# Altium schematic sheet 08_FPGA.SchDoc: FPGA
size A3; Organization: Lime Microsystems; Address1: Surrey Tech Centre; Address2: Guildford GU2 7YG; Address3: Surrey; Address4: United Kingdom; Revision: v1.1; SheetNumber: 8; SheetTotal: 10
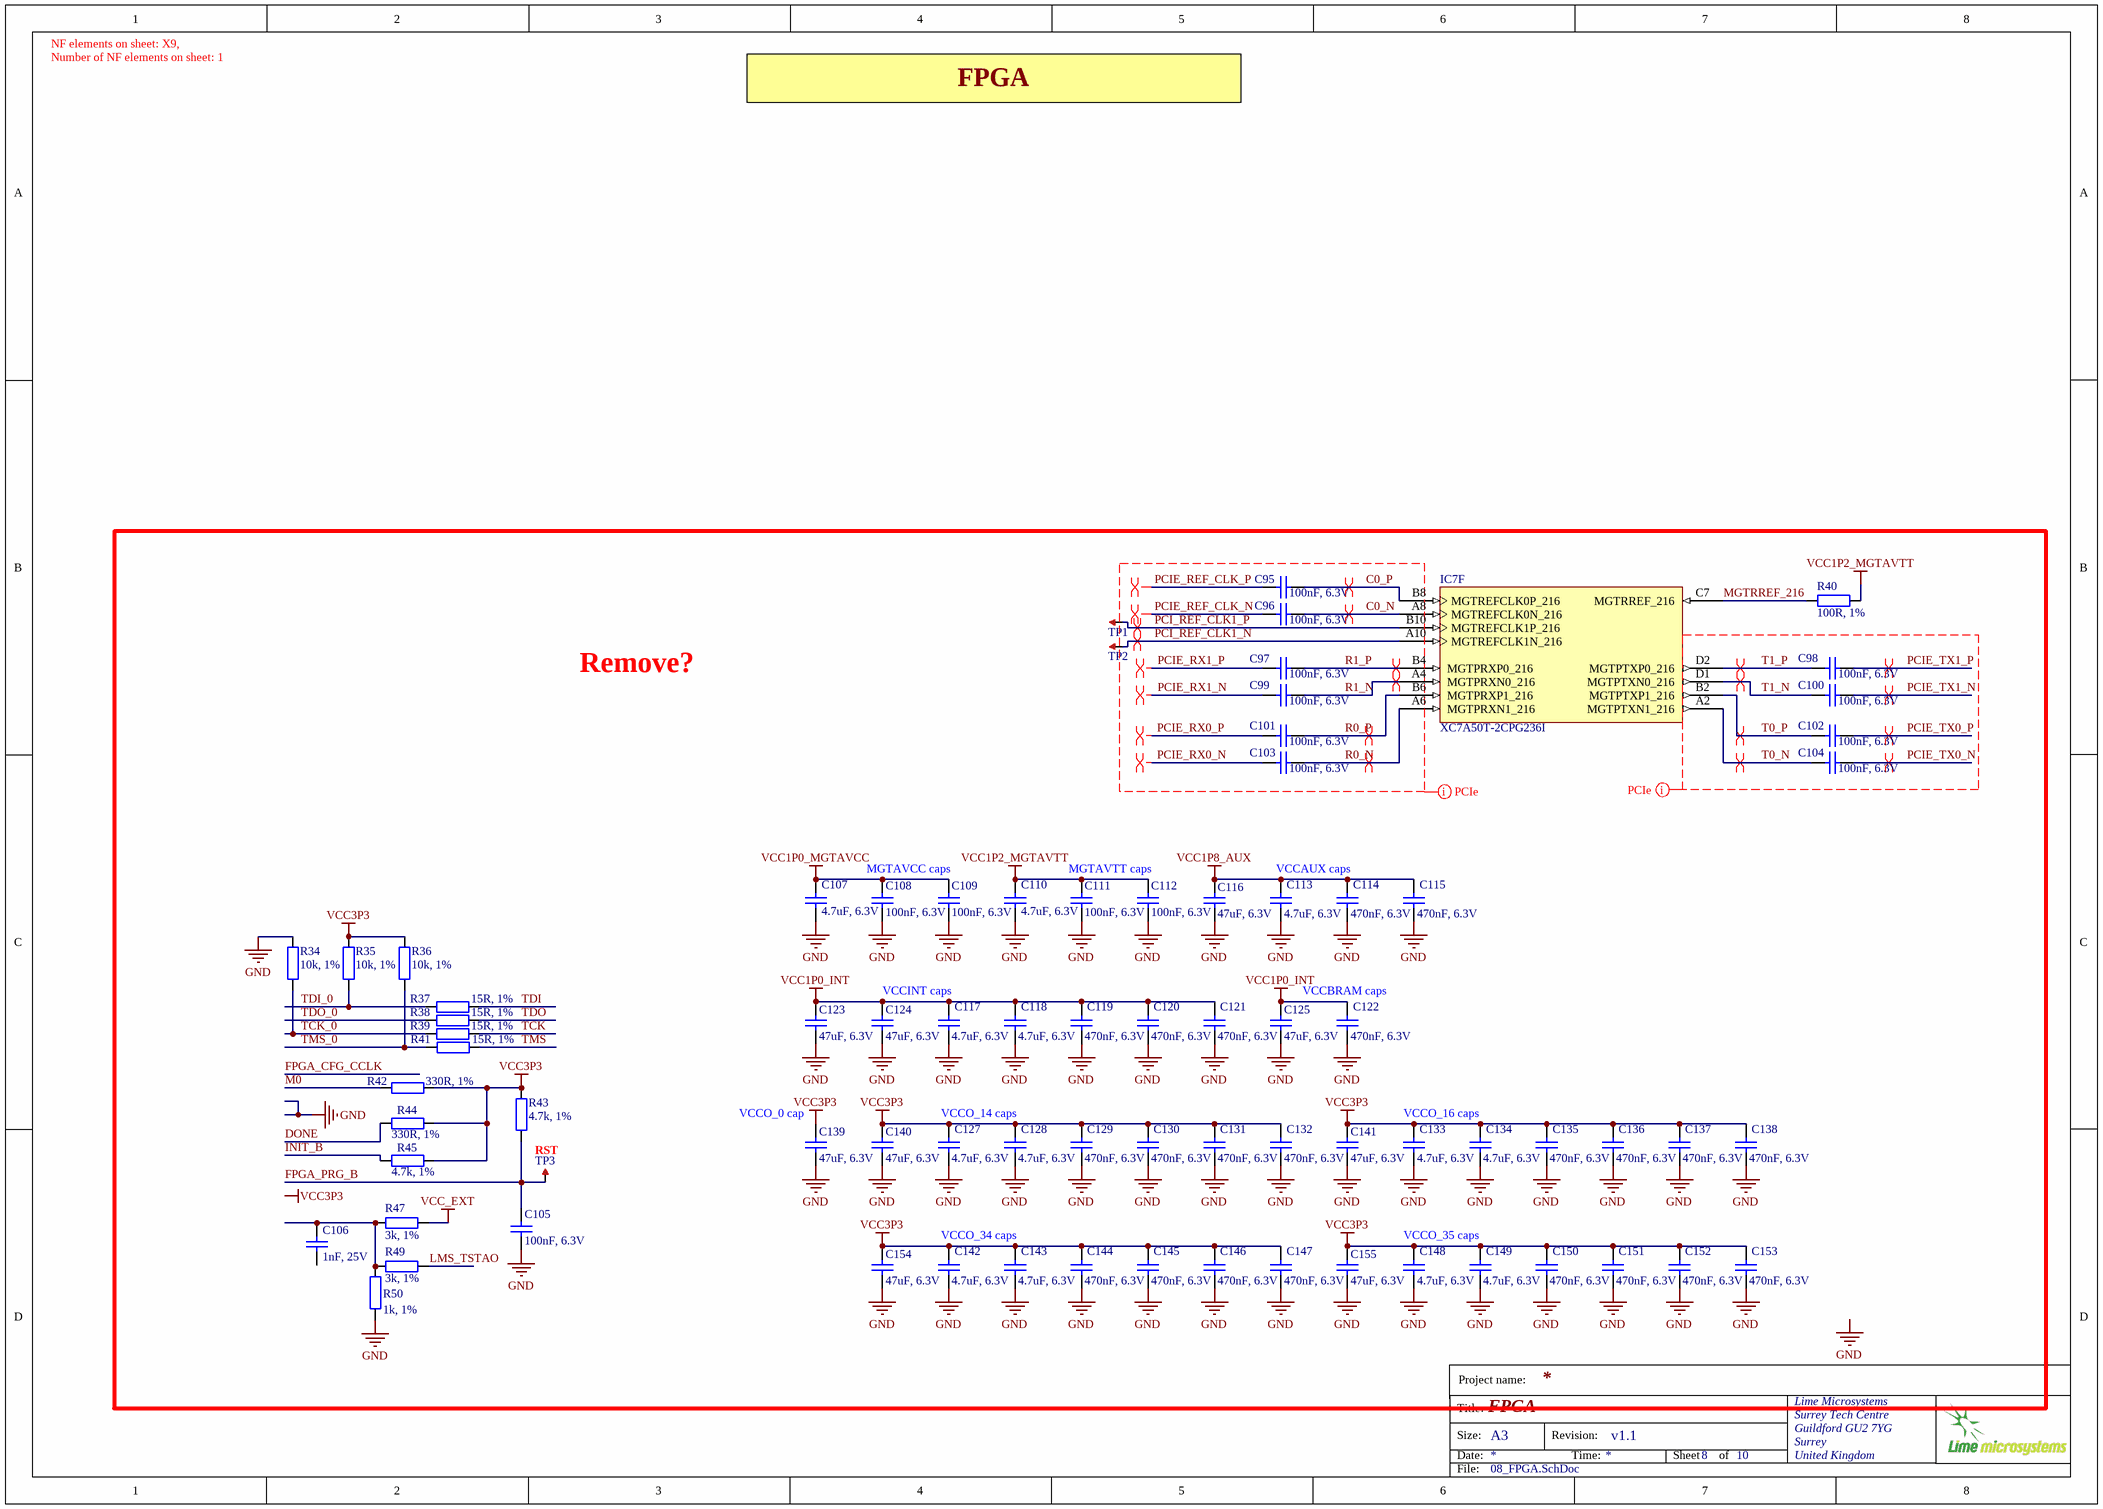
[diagram p0: 08_FPGA.SchDoc]

## Parts
C95  100nF, 6.3V  [CAP0201]
C96  100nF, 6.3V  [CAP0201]
C97  100nF, 6.3V  [CAP0201]
C98  100nF, 6.3V  [CAP0201]
C99  100nF, 6.3V  [CAP0201]
C100  100nF, 6.3V  [CAP0201]
C101  100nF, 6.3V  [CAP0201]
C102  100nF, 6.3V  [CAP0201]
C103  100nF, 6.3V  [CAP0201]
C104  100nF, 6.3V  [CAP0201]
C105  100nF, 6.3V  [CAP0201]
C106  1nF, 25V  [CAP0201]
C107  4.7uF, 6.3V  [CAP0402]
C108  100nF, 6.3V  [CAP0201]
C109  100nF, 6.3V  [CAP0201]
C110  4.7uF, 6.3V  [CAP0402]
C111  100nF, 6.3V  [CAP0201]
C112  100nF, 6.3V  [CAP0201]
C113  4.7uF, 6.3V  [CAP0402]
C114  470nF, 6.3V  [CAP0201]
C115  470nF, 6.3V  [CAP0201]
C116  47uF, 6.3V  [CAP0603]
C117  4.7uF, 6.3V  [CAP0402]
C118  4.7uF, 6.3V  [CAP0402]
C119  470nF, 6.3V  [CAP0201]
C120  470nF, 6.3V  [CAP0201]
C121  470nF, 6.3V  [CAP0201]
C122  470nF, 6.3V  [CAP0201]
C123  47uF, 6.3V  [CAP0603]
C124  47uF, 6.3V  [CAP0603]
C125  47uF, 6.3V  [CAP0603]
C127  4.7uF, 6.3V  [CAP0402]
C128  4.7uF, 6.3V  [CAP0402]
C129  470nF, 6.3V  [CAP0201]
C130  470nF, 6.3V  [CAP0201]
C131  470nF, 6.3V  [CAP0201]
C132  470nF, 6.3V  [CAP0201]
C133  4.7uF, 6.3V  [CAP0402]
C134  4.7uF, 6.3V  [CAP0402]
C135  470nF, 6.3V  [CAP0201]
C136  470nF, 6.3V  [CAP0201]
C137  470nF, 6.3V  [CAP0201]
C138  470nF, 6.3V  [CAP0201]
C139  47uF, 6.3V  [CAP0603]
C140  47uF, 6.3V  [CAP0603]
C141  47uF, 6.3V  [CAP0603]
C142  4.7uF, 6.3V  [CAP0402]
C143  4.7uF, 6.3V  [CAP0402]
C144  470nF, 6.3V  [CAP0201]
C145  470nF, 6.3V  [CAP0201]
C146  470nF, 6.3V  [CAP0201]
C147  470nF, 6.3V  [CAP0201]
C148  4.7uF, 6.3V  [CAP0402]
C149  4.7uF, 6.3V  [CAP0402]
C150  470nF, 6.3V  [CAP0201]
C151  470nF, 6.3V  [CAP0201]
C152  470nF, 6.3V  [CAP0201]
C153  470nF, 6.3V  [CAP0201]
C154  47uF, 6.3V  [CAP0603]
C155  47uF, 6.3V  [CAP0603]
IC7  XC7A50T-2CPG236I  [XC7A35T-2CPG236]  (part F of 10)
R34  10k, 1%  [RES0201]
R35  10k, 1%  [RES0201]
R36  10k, 1%  [RES0201]
R37  15R, 1%  [RES0201]
R38  15R, 1%  [RES0201]
R39  15R, 1%  [RES0201]
R40  100R, 1%  [RES0201]
R41  15R, 1%  [RES0201]
R42  330R, 1%  [RES0201]
R43  4.7k, 1%  [RES0201]
R44  330R, 1%  [RES0201]
R45  4.7k, 1%  [RES0201]
R47  3k, 1%  [RES0201]
R49  3k, 1%  [RES0201]
R50  1k, 1%  [RES0201]
TP1  TESTPOINT_PAD  [TP_PAD_1MM]  (value not drawn)  (no BOM)
TP2  TESTPOINT_PAD  [TP_PAD_1MM]  (value not drawn)  (no BOM)
TP3  TESTPOINT_PAD  [TP_PAD_1MM]  (value not drawn)  (no BOM)

## Nets
GND: C105.2 C107.1 C108.2 C109.2 C110.1 C111.2 C112.2 C113.1 C114.2 C115.2 C116.1 C117.1 C118.1 C119.2 C120.2 C121.2 C122.2 C123.1 C124.1 C125.1 C127.1 C128.1 C129.2 C130.2 C131.2 C132.2 C133.1 C134.1 C135.2 C136.2 C137.2 C138.2 C139.1 C140.1 C141.1 C142.1 C143.1 C144.2 C145.2 C146.2 C147.2 C148.1 C149.1 C150.2 C151.2 C152.2 C153.2 C154.1 C155.1 R34.1 R50.2
VCC1P0_INT: C117.2 C118.2 C119.1 C120.1 C121.1 C122.1 C123.2 C124.2 C125.2
VCC1P0_MGTAVCC: C107.2 C108.1 C109.1
VCC1P2_MGTAVTT: C110.2 C111.1 C112.1 R40.1
VCC1P8_AUX: C113.2 C114.1 C115.1 C116.2
VCC3P3: C127.2 C128.2 C129.1 C130.1 C131.1 C132.1 C133.2 C134.2 C135.1 C136.1 C137.1 C138.1 C139.2 C140.2 C141.2 C142.2 C143.2 C144.1 C145.1 C146.1 C147.1 C148.2 C149.2 C150.1 C151.1 C152.1 C153.1 C154.2 C155.2 R35.1 R36.1 R42.1 R43.1 R44.1 R45.1
VCC_EXT: R47.2
C0_N: C96.2 IC7.A8(MGTREFCLK0N_216)
C0_P: C95.2 IC7.B8(MGTREFCLK0P_216)
DONE: R44.2
FPGA_PRG_B: C105.1 R43.2 TP3.1
INIT_B: R45.2
LMS_TSTAO: R49.2
M0: R42.2
MGTRREF_216: IC7.C7(MGTRREF_216) R40.2
PCI_REF_CLK1_N: IC7.A10(MGTREFCLK1N_216) TP2.1
PCI_REF_CLK1_P: IC7.B10(MGTREFCLK1P_216) TP1.1
PCIE_REF_CLK_N: C96.1
PCIE_REF_CLK_P: C95.1
PCIE_RX0_N: C103.1
PCIE_RX0_P: C101.1
PCIE_RX1_N: C99.1
PCIE_RX1_P: C97.1
PCIE_TX0_N: C104.2
PCIE_TX0_P: C102.2
PCIE_TX1_N: C100.2
PCIE_TX1_P: C98.2
R0_N: C103.2 IC7.A6(MGTPRXN1_216)
R0_P: C101.2 IC7.B6(MGTPRXP1_216)
R1_N: C99.2 IC7.A4(MGTPRXN0_216)
R1_P: C97.2 IC7.B4(MGTPRXP0_216)
T0_N: C104.1 IC7.A2(MGTPTXN1_216)
T0_P: C102.1 IC7.B2(MGTPTXP1_216)
T1_N: C100.1 IC7.D1(MGTPTXN0_216)
T1_P: C98.1 IC7.D2(MGTPTXP0_216)
TCK: R39.1
TCK_0: R34.2 R39.2
TDI: R37.1
TDI_0: R35.2 R37.2
TDO: R38.1
TDO_0: R38.2
TMS: R41.1
TMS_0: R36.2 R41.2
NetC106_1: C106.1 R47.1 R49.1 R50.1

Not connected (* = marked no-connect by the designer): C106 2

## Layout directives
differential pair: C0_N, C0_P, PCI_REF_CLK1_N, PCI_REF_CLK1_P, PCIE_REF_CLK_N, PCIE_REF_CLK_P, PCIE_RX0_N, PCIE_RX0_P, PCIE_RX1_N, PCIE_RX1_P, PCIE_TX0_N, PCIE_TX0_P, PCIE_TX1_N, PCIE_TX1_P, R0_N, R0_P, R1_N, R1_P, T0_N, T0_P, T1_N, T1_P
net class PCIe: C0_N, C0_P, PCI_REF_CLK1_N, PCI_REF_CLK1_P, PCIE_REF_CLK_N, PCIE_REF_CLK_P, PCIE_RX0_N, PCIE_RX0_P, PCIE_RX1_N, PCIE_RX1_P, PCIE_TX0_N, PCIE_TX0_P, PCIE_TX1_N, PCIE_TX1_P, R0_N, R0_P, R1_N, R1_P, T0_N, T0_P, T1_N, T1_P

## Notes on the sheet
- NF elements on sheet: X9,
- Number of NF elements on sheet: 1
- FPGA
- Remove?
- MGTAVCC caps
- MGTAVTT caps
- VCCAUX caps
- VCCINT caps
- VCCBRAM caps
- (near C139) VCCO_0 cap
- VCCO_14 caps
- VCCO_16 caps
- RST
- VCCO_34 caps
- VCCO_35 caps
- Labels drawn without touching a wire or pin: GND, VCC3P3
- Project name:
- Title:
- Size:
- Date:
- A3
- Revision:
- Time:
- Sheet
- of
- File:

## Library data of the parts
C95-C97 C99 C101 C103 C105 C108 C109 C111 C112 = Cap_0402: Part Description: 100 pF ±5% 50V Ceramic Capacitor C0G, NP0 0201 (0603 Metric); Manufacturer: Samsung; Manufacturer Part Number 1: CL03A104MP3NNNC; Tolerance: 20%; Voltage Rating (DC): 10V; Value: 100nF, 6.3V; Capacitance: 100nF; Case/Package: 0201; Case Code (Imperial): 0201; Case Code (Metric): 0603; ComponentLink5Description: https://datasheet.ciiva.com/25788/cl03a104mp3nnnc-25788272.pdf?src-supplier=Digi-Key; ComponentLink5URL: https://datasheet.ciiva.com/25788/cl03a104mp3nnnc-25788272.pdf?src-supplier=Digi-Key; Length: 0.024inch; Max Operating Temperature: 85°C; Min Operating Temperature: -55°C; Mount: Surface Mount; Package Quantity: 1; Packaging: Tape and Reel; Pricing 1: 1=0,10000, 10=0,03000, 50=0,01640, 100=0,01330, 500=0,00950, 1000=0,00747, 2500=0,00679, 5000=0,00625 (USD); RoHS: Yes; RoHS Compliant: Yes; Series: CL; Stock 1: 3817176; Supplier 1: Digi-Key; Supplier Part Number 1: 1276-1321-1-ND; Thickness: 0.013inch; Voltage Rating: 10V; Width: 0.012inch
C98 C100 C102 C104 = Cap_0402: Manufacturer: Samsung; Manufacturer Part Number 1: CL03A104MP3NNNC; Part Description: 100 pF ±5% 50V Ceramic Capacitor C0G, NP0 0201 (0603 Metric); Tolerance: 20%; Voltage Rating (DC): 10V; ComponentLink5Description: https://datasheet.ciiva.com/25788/cl03a104mp3nnnc-25788272.pdf?src-supplier=Digi-Key; ComponentLink5URL: https://datasheet.ciiva.com/25788/cl03a104mp3nnnc-25788272.pdf?src-supplier=Digi-Key; Capacitance: 100nF; Case/Package: 0201; Case Code (Imperial): 0201; Case Code (Metric): 0603; Length: 0.024inch; Max Operating Temperature: 85°C; Min Operating Temperature: -55°C; Mount: Surface Mount; Package Quantity: 1; Packaging: Tape and Reel; Pricing 1: 1=0,10000, 10=0,03000, 50=0,01640, 100=0,01330, 500=0,00950, 1000=0,00747, 2500=0,00679, 5000=0,00625 (USD); RoHS: Yes; RoHS Compliant: Yes; Series: CL; Stock 1: 3817176; Supplier 1: Digi-Key; Supplier Part Number 1: 1276-1321-1-ND; Thickness: 0.013inch; Value: 100nF, 6.3V; Voltage Rating: 10V; Width: 0.012inch
C106 = Cap_0402: Manufacturer Part Number 1: C0603X7R1E102K030BA; Manufacturer: TDK Corporation; Part Description: 1000pF ±10% 25V X7R Ceramic Capacitor -55°C ~ 125°C Surface Mount, MLCC 0201 (0603 Metric) 0.024" L x 0.012" W (0.60mm x 0.30mm); Temperature Coefficient: X7R; Tolerance: ±10%; Capacitance: 1000pF; Value: 1nF, 25V; Supplier 1: Digi-Key; Supplier Part Number 1: 445-7275-1-ND; Voltage - Rated: 25V; Features: -; Package / Case: 0201 (0603 Metric); Lead Spacing: -; Mounting Type: Surface Mount, MLCC; Lead Style: -; Height - Seated (Max): -; Operating Temperature: -55°C ~ 125°C; Size / Dimension: 0.024" L x 0.012" W (0.60mm x 0.30mm); Applications: General Purpose; Ratings: -; Thickness (Max): 0.013" (0.33mm); RoHS: RoHS Compliant; Packaging: Cut Tape (CT); Category: Capacitors
C107 C110 C113 C117 C118 C127 C128 C133 C134 C142 C143 C148 C149 = Cap_0402: Manufacturer: Murata Electronics North America; Manufacturer Part Number 1: GRM155R60J475ME87D; Part Description: 4.7µF ±20% 6.3V X5R Ceramic Capacitor -55°C ~ 85°C Surface Mount, MLCC 0402 (1005 Metric) 0.039" L x 0.020" W (1.00mm x 0.50mm); Tolerance: ±20%; Capacitance: 4.7µF; Temperature Coefficient: X5R; Lead Style: -; Ratings: -; Height - Seated (Max): -; Thickness (Max): 0.022" (0.55mm); Voltage - Rated: 6.3V; Packaging: Cut Tape (CT); Lead Spacing: -; Category: Capacitors; Supplier Part Number 1: 490-5408-1-ND; Applications: General Purpose; Operating Temperature: -55°C ~ 85°C; Mounting Type: Surface Mount, MLCC; Features: Derating Recommended; RoHS: RoHS Compliant; Supplier 1: Digi-Key; Package / Case: 0402 (1005 Metric); Size / Dimension: 0.039" L x 0.020" W (1.00mm x 0.50mm); Value: 4.7uF, 6.3V
C114 C115 C119-C122 C129-C132 C135-C138 C144-C147 C150-C153 = Cap_0402: Manufacturer: Murata; Manufacturer Part Number 1: GRM033R60J474KE90D; Part Description: 0.47 µF ±10% 6.3V Ceramic Capacitor X5R 0201 (0603 Metric); Tolerance: 10%; Dielectric: X5R; Value: 470nF, 6.3V; Supplier 1: Digi-Key; Supplier Part Number 1: 490-10409-1-ND; Stock 1: 1562532; Pricing 1: 1=0,10000, 10=0,06000, 50=0,03280, 100=0,02670, 500=0,01908, 1000=0,01500, 2500=0,01364, 5000=0,01254 (USD); RoHS: Yes; Mount: Surface Mount; Case/Package: 0201; Case Code (Metric): 0603; Case Code (Imperial): 0201; Weight: 1.2E-05oz; Min Operating Temperature: -55°C; Max Operating Temperature: 85°C; Packaging: Tape and Reel; Capacitance: 470nF; Voltage Rating: 6.3V; Termination: SMD/SMT; Voltage Rating (DC): 6.3V; Package Quantity: 15000; Length: 0.6mm; Width: 0.012inch; Height: 0.3mm; Thickness: 0.013inch; Depth: 0.3mm; Lead Free: Lead Free; RoHS Compliant: Yes; ComponentLink1URL: http://www.farnell.com/datasheets/2867834.pdf?src-supplier=Farnell; ComponentLink1Description: http://www.farnell.com/datasheets/2867834.pdf?src-supplier=Farnell; ComponentLink2URL: http://www.mouser.com/ds/2/281/c02e-2905.pdf?src-supplier=Mouser; ComponentLink2Description: http://www.mouser.com/ds/2/281/c02e-2905.pdf?src-supplier=Mouser; ComponentLink3URL: http://www.farnell.com/datasheets/2867834.pdf?src-supplier=Element14; ComponentLink3Description: http://www.farnell.com/datasheets/2867834.pdf?src-supplier=Element14; ComponentLink4URL: http://search.murata.co.jp/Ceramy/image/img/A01X/G101/ENG/GRM033R60J474KE90-01.pdf?src-supplier=Digi-Key; ComponentLink4Description: http://search.murata.co.jp/Ceramy/image/img/A01X/G101/ENG/GRM033R60J474KE90-01.pdf?src-supplier=Digi-Key; ComponentLink5URL: http://www.farnell.com/datasheets/2867834.pdf?src-supplier=Newark; ComponentLink5Description: http://www.farnell.com/datasheets/2867834.pdf?src-supplier=Newark
C116 C123-C125 C139-C141 C154 C155 = Cap_0603: Part Description: 47 µF ±20% 6.3V Ceramic Capacitor X5R 0603 (1608 Metric); Manufacturer: Murata; Manufacturer Part Number 1: GRM188R60J476ME15D; Tolerance: 20%; Dielectric: X5R; Value: 47uF, 6.3V; Supplier 1: Digi-Key; Supplier Part Number 1: 490-13247-1-ND; Stock 1: 731453; Pricing 1: 1=0,45000, 10=0,31900, 50=0,24120, 100=0,21000, 500=0,15556, 1000=0,13223 (USD); RoHS: Yes; Mount: Surface Mount; Case/Package: 0603; Case Code (Metric): 1608; Case Code (Imperial): 0603; Min Operating Temperature: -55°C; Max Operating Temperature: 85°C; Packaging: Tape and Reel; Capacitance: 47uF; Voltage Rating: 6.3V; Voltage Rating (DC): 6.3V; Length: 0.063inch; Width: 0.031inch; Thickness: 0.039inch; RoHS Compliant: Yes; ComponentLink1URL: http://search.murata.co.jp/Ceramy/image/img/A01X/G101/ENG/GRM188R60J476ME15-01.pdf?src-supplier=Digi-Key; ComponentLink1Description: http://search.murata.co.jp/Ceramy/image/img/A01X/G101/ENG/GRM188R60J476ME15-01.pdf?src-supplier=Digi-Key; ComponentLink2URL: https://www.murata.com/~/media/webrenewal/support/library/catalog/products/capacitor/mlcc/c02e.ashx?la=en-us&src-supplier=Digi-Key; ComponentLink2Description: https://www.murata.com/~/media/webrenewal/support/library/catalog/products/capacitor/mlcc/c02e.ashx?la=en-us&src-supplier=Digi-Key
IC7 = XC7A35T-2CPG236: Artix-7 FPGA; Part Description: Artix-7 Field Programmable Gate Array (FPGA) IC 106 2764800 52160 238-LFBGA, CSPBGA; Manufacturer: Xilinx; Propagation Delay: 0.85ns; Speed Grade: 2; Number of Logic Blocks (LABs): 4075; Number of Logic Elements/Cells: 52160; RAM Size: 2764800b; Number of I/Os: 106; Number of Registers: 652; Min Supply Voltage: 950mV; Max Supply Voltage: 1.05V; ComponentLink1Description: Manufacturer URL; ComponentLink1URL: http://www.xilinx.com/; ComponentLink2Description: Datasheet; ComponentLink2URL: http://www.xilinx.com/support/documentation/data_sheets/ds180_7Series_Overview.pdf; ComponentLink3Description: Package Specification; ComponentLink3URL: http://www.xilinx.com/support/documentation/user_guides/ug475_7Series_Pkg_Pinout.pdf; ComponentLink4Description: DC and Switching Characteristics; ComponentLink4URL: http://www.xilinx.com/support/documentation/data_sheets/ds181_Artix_7_Data_Sheet.pdf; ComponentLink5Description: Package File; ComponentLink5URL: http://www.xilinx.com/support/packagefiles/a7packages/xc7a200tsbg484pkg.txt; ComponentLink6Description: Packaging and Pinout; ComponentLink6URL: http://www.xilinx.com/support/documentation/user_guides/ug475_7Series_Pkg_Pinout.pdf; ComponentLink7URL: http://www.farnell.com/datasheets/2553941.pdf?src-supplier=Farnell; ComponentLink7Description: http://www.farnell.com/datasheets/2553941.pdf?src-supplier=Farnell; ComponentLink8URL: http://www.xilinx.com/support/documentation/data_sheets/ds181_Artix_7_Data_Sheet.pdf?src-supplier=Avnet; ComponentLink8Description: http://www.xilinx.com/support/documentation/data_sheets/ds181_Artix_7_Data_Sheet.pdf?src-supplier=Avnet; ComponentLink9URL: https://www.xilinx.com/support/documentation/data_sheets/ds180_7Series_Overview.pdf?src-supplier=Digi-Key; ComponentLink9Description: https://www.xilinx.com/support/documentation/data_sheets/ds180_7Series_Overview.pdf?src-supplier=Digi-Key; Supplier 1: Digi-Key; Supplier Part Number 1: 122-2181-ND; Manufacturer Part Number 1: XC7A50T-2CPG236I; Stock 1: 0; RoHS: Yes; Mount: Surface Mount; Number of Pins: 236; Contact Plating: Copper,Tin,Silver; Min Operating Temperature: -40°C; Max Operating Temperature: 100°C; Turn-On Delay Time: 0.85ns; RoHS Compliant: Yes
R34-R36 = Res_0402: Manufacturer: Yageo; Manufacturer Part Number 1: RC0201FR-0710KL; Part Description: 10 kOhms ±1% 0.05W, 1/20W Chip Resistor 0201 (0603 Metric) Moisture Resistant Thick Film; Resistance: 10kR; Power Rating: 50mW; Voltage Rating: 25V; Temperature Coefficient: 200ppm/°C; Value: 10k, 1%; ComponentLink1URL: https://datasheet.ciiva.com/5924/1563626-5924912.pdf?src-supplier=Farnell; ComponentLink1Description: https://datasheet.ciiva.com/5924/1563626-5924912.pdf?src-supplier=Farnell; ComponentLink2URL: https://datasheet.ciiva.com/22661/1563626-22661319.pdf?src-supplier=Element14; ComponentLink2Description: https://datasheet.ciiva.com/22661/1563626-22661319.pdf?src-supplier=Element14; Supplier 1: Digi-Key; Supplier Part Number 1: 311-10.0KMCT-ND; Stock 1: 17142315; Pricing 1: 1=0,10000, 10=0,03700, 100=0,01530, 1000=0,00685, 2500=0,00595, 5000=0,00491 (USD); RoHS: Yes; Case/Package: 0201; Number of Pins: 2; Case Code (Imperial): 0201; Case Code (Metric): 0603; Contact Plating: Tin,Matte; Weight: 6E-06oz; Min Operating Temperature: -55°C; Max Operating Temperature: 125°C; Tolerance: 1%; Packaging: Tape and Reel; Package Quantity: 10000; Termination: SMD/SMT; Resistor Type: Thick Film; Number of Terminations: 2; Max Power Dissipation: 50mW; Voltage Rating (DC): 25V; Features: Moisture Resistant; Series: RC; Resistance Tolerance: 1%; Construction: Rectangular; Working Voltage: 25V; Technology: THICK FILM; Length: 0.6mm; Width: 0.012inch; Height: 0.01inch; Depth: 0.3mm; Radiation Hardening: No; Reach SVHC Compliant: Yes; Military Standard: Not; Lead Free: Lead Free; RoHS Compliant: Yes; ComponentLink3URL: https://datasheet.ciiva.com/7660/1421516-7660807.pdf?src-supplier=Element14; ComponentLink3Description: https://datasheet.ciiva.com/7660/1421516-7660807.pdf?src-supplier=Element14; ComponentLink4URL: https://datasheet.ciiva.com/46391/1421516-46391339.pdf?src-supplier=Element14; ComponentLink4Description: https://datasheet.ciiva.com/46391/1421516-46391339.pdf?src-supplier=Element14; ComponentLink5URL: https://datasheet.ciiva.com/2467/pyu-r-int-thick-7-2467110.pdf?src-supplier=Digi-Key; ComponentLink5Description: https://datasheet.ciiva.com/2467/pyu-r-int-thick-7-2467110.pdf?src-supplier=Digi-Key; ComponentLink6URL: https://datasheet.ciiva.com/2467/pyu-r-int-thick-7-2467111.pdf?src-supplier=Digi-Key; ComponentLink6Description: https://datasheet.ciiva.com/2467/pyu-r-int-thick-7-2467111.pdf?src-supplier=Digi-Key; ComponentLink7URL: https://datasheet.ciiva.com/2467/pyu-r-int-thick-7-2467109.pdf?src-supplier=Digi-Key; ComponentLink7Description: https://datasheet.ciiva.com/2467/pyu-r-int-thick-7-2467109.pdf?src-supplier=Digi-Key
R37-R39 R41 = Res_0402: Manufacturer: Yageo; Manufacturer Part Number 1: RC0201FR-0715RL; Part Description: 15 Ohms ±1% 0.05W, 1/20W Chip Resistor 0201 (0603 Metric) Moisture Resistant Thick Film; Power Rating: 50mW; Voltage Rating: 25V; Temperature Coefficient: 200ppm/°C; Value: 15R, 1%; ComponentLink1URL: https://datasheet.ciiva.com/5924/1563626-5924912.pdf?src-supplier=Farnell; ComponentLink1Description: https://datasheet.ciiva.com/5924/1563626-5924912.pdf?src-supplier=Farnell; ComponentLink2URL: https://datasheet.ciiva.com/22661/1563626-22661319.pdf?src-supplier=Element14; ComponentLink2Description: https://datasheet.ciiva.com/22661/1563626-22661319.pdf?src-supplier=Element14; Supplier 1: Digi-Key; Supplier Part Number 1: 311-15.0MCT-ND; Stock 1: 379739; Pricing 1: 1=0,10000, 10=0,03700, 100=0,01530, 1000=0,00685, 2500=0,00595, 5000=0,00491 (USD); RoHS: Yes; Case/Package: 0201; Case Code (Imperial): 0201; Case Code (Metric): 0603; Size Code: 0201; Min Operating Temperature: -55°C; Max Operating Temperature: 125°C; Resistance: 15R; Tolerance: 1%; Packaging: Cut Tape; Package Quantity: 1; Termination: SMD/SMT; Resistor Type: Thick Film; Number of Terminations: 2; Max Power Dissipation: 50mW; Features: Moisture Resistant; Series: RC; Resistance Tolerance: 1%; Length: 0.6mm; Width: 0.3mm; Height: 0.23mm; Lead Free: Lead Free; RoHS Compliant: Yes; ComponentLink3URL: https://datasheet.ciiva.com/7672/1563626-7672202.pdf?src-supplier=Element14; ComponentLink3Description: https://datasheet.ciiva.com/7672/1563626-7672202.pdf?src-supplier=Element14; ComponentLink4URL: https://datasheet.ciiva.com/2493/pyu-r-int-thick-7-2493785.pdf?src-supplier=Digi-Key; ComponentLink4Description: https://datasheet.ciiva.com/2493/pyu-r-int-thick-7-2493785.pdf?src-supplier=Digi-Key; ComponentLink5URL: https://datasheet.ciiva.com/2493/pyu-r-int-thick-7-2493786.pdf?src-supplier=Digi-Key; ComponentLink5Description: https://datasheet.ciiva.com/2493/pyu-r-int-thick-7-2493786.pdf?src-supplier=Digi-Key; ComponentLink6URL: https://datasheet.ciiva.com/2493/pyu-r-int-thick-7-2493784.pdf?src-supplier=Digi-Key; ComponentLink6Description: https://datasheet.ciiva.com/2493/pyu-r-int-thick-7-2493784.pdf?src-supplier=Digi-Key
R40 = Res_0402: Manufacturer: Yageo; Manufacturer Part Number 1: RC0201FR-07100RL; Part Description: 100 Ohms ±1% 0.05W, 1/20W Chip Resistor 0201 (0603 Metric) Moisture Resistant Thick Film; Power Rating: 50mW; Voltage Rating: 25V; Temperature Coefficient: 200ppm/°C; ComponentLink1URL: http://www.yageo.com/documents/recent/PYu-RC_Group_51_RoHS_L_7.pdf; ComponentLink1Description: http://www.yageo.com/documents/recent/PYu-RC_Group_51_RoHS_L_7.pdf; Value: 100R, 1%; Supplier 1: Digi-Key; Supplier Part Number 1: 311-100MCT-ND; Stock 1: 1625377; Pricing 1: 1=0,10000, 10=0,03700, 100=0,01530, 1000=0,00685, 2500=0,00595, 5000=0,00491 (USD); RoHS: Yes; Case/Package: 0201; Case Code (Metric): 0603; Case Code (Imperial): 0201; Contact Plating: Tin,Matte; Size Code: 0201; Min Operating Temperature: -55°C; Max Operating Temperature: 125°C; Resistance: 100R; Tolerance: 1%; Packaging: Cut Tape; Package Quantity: 1; Resistor Type: Thick Film; Number of Terminations: 2; Termination: SMD/SMT; Max Power Dissipation: 50mW; Features: Moisture Resistant; Series: RC; Resistance Tolerance: 1%; Length: 0.024inch; Width: 0.012inch; Height: 0.01inch; Radiation Hardening: No; Lead Free: Lead Free; RoHS Compliant: Yes; ComponentLink2URL: https://datasheet.ciiva.com/2560/pyu-r-int-thick-7-2560866.pdf?src-supplier=Digi-Key; ComponentLink2Description: https://datasheet.ciiva.com/2560/pyu-r-int-thick-7-2560866.pdf?src-supplier=Digi-Key; ComponentLink3URL: https://datasheet.ciiva.com/2560/pyu-r-int-thick-7-2560867.pdf?src-supplier=Digi-Key; ComponentLink3Description: https://datasheet.ciiva.com/2560/pyu-r-int-thick-7-2560867.pdf?src-supplier=Digi-Key; ComponentLink4URL: https://datasheet.ciiva.com/2560/pyu-r-int-thick-7-2560865.pdf?src-supplier=Digi-Key; ComponentLink4Description: https://datasheet.ciiva.com/2560/pyu-r-int-thick-7-2560865.pdf?src-supplier=Digi-Key; ComponentLink5URL: https://datasheet.ciiva.com/8887/pyu-rc0201-51-rohs-l-8-8887865.pdf?src-supplier=Avnet; ComponentLink5Description: https://datasheet.ciiva.com/8887/pyu-rc0201-51-rohs-l-8-8887865.pdf?src-supplier=Avnet
R42 R44 = Res_0402: Part Description: 330 Ohms ±1% 0.05W, 1/20W Chip Resistor 0201 (0603 Metric) Thick Film; Manufacturer: Vishay Dale; Manufacturer Part Number 1: CRCW0201330RFKED; Power Rating: 50mW; Voltage Rating: 30V; Temperature Coefficient: 100ppm/°C; Value: 330R, 1%; Supplier 1: Digi-Key; Supplier Part Number 1: 541-330AABCT-ND; Stock 1: 245078; Pricing 1: 1=0,27000, 10=0,23000, 100=0,08990, 1000=0,03762, 2500=0,03448, 5000=0,03135 (USD); RoHS: Yes; Case/Package: 0201; Weight: 6E-06oz; Case Code (Imperial): 0201; Case Code (Metric): 0603; Contact Plating: Tin; Size Code: 0201; Min Operating Temperature: -55°C; Max Operating Temperature: 155°C; Resistance: 330R; Tolerance: 1%; Packaging: Tape and Reel; Package Quantity: 1; Resistor Type: Thick Film; Number of Terminations: 2; Max Power Dissipation: 50mW; Series: CRCW; Construction: Rectangular; Length: 0.6mm; Width: 0.3mm; Height: 0.011inch; Depth: 0.3mm; Radiation Hardening: No; Military Standard: Not; Lead Free: Lead Free; RoHS Compliant: Yes; ComponentLink1URL: https://datasheet.ciiva.com/8944/crcw0201e3-8944937.pdf?src-supplier=Avnet; ComponentLink1Description: https://datasheet.ciiva.com/8944/crcw0201e3-8944937.pdf?src-supplier=Avnet; ComponentLink2URL: https://datasheet.ciiva.com/2473/crcw0201e3-2473436.pdf?src-supplier=Digi-Key; ComponentLink2Description: https://datasheet.ciiva.com/2473/crcw0201e3-2473436.pdf?src-supplier=Digi-Key; ComponentLink3URL: https://datasheet.ciiva.com/2473/crcw0201e3-2473437.pdf?src-supplier=Digi-Key; ComponentLink3Description: https://datasheet.ciiva.com/2473/crcw0201e3-2473437.pdf?src-supplier=Digi-Key; ComponentLink4URL: https://datasheet.ciiva.com/2473/crcw0201e3-2473438.pdf?src-supplier=Digi-Key; ComponentLink4Description: https://datasheet.ciiva.com/2473/crcw0201e3-2473438.pdf?src-supplier=Digi-Key; ComponentLink5URL: https://datasheet.ciiva.com/16394/dcrcwe3-16394575.pdf?src-supplier=Future+Electronics; ComponentLink5Description: https://datasheet.ciiva.com/16394/dcrcwe3-16394575.pdf?src-supplier=Future+Electronics
R43 R45 = Res_0402: Manufacturer: Yageo; Manufacturer Part Number 1: RC0201FR-074K7L; Part Description: 4.7 kOhms ±1% 0.05W, 1/20W Chip Resistor 0201 (0603 Metric) Moisture Resistant Thick Film; Resistance: 4.7kR; Power Rating: 50mW; Voltage Rating: 25V; Temperature Coefficient: 200ppm/°C; Value: 4.7k, 1%; ComponentLink1URL: https://datasheet.ciiva.com/5924/1563626-5924912.pdf?src-supplier=Farnell; ComponentLink1Description: https://datasheet.ciiva.com/5924/1563626-5924912.pdf?src-supplier=Farnell; ComponentLink2URL: https://datasheet.ciiva.com/22661/1563626-22661319.pdf?src-supplier=Element14; ComponentLink2Description: https://datasheet.ciiva.com/22661/1563626-22661319.pdf?src-supplier=Element14; ComponentLink3URL: https://datasheet.ciiva.com/7672/1563626-7672202.pdf?src-supplier=Element14; ComponentLink3Description: https://datasheet.ciiva.com/7672/1563626-7672202.pdf?src-supplier=Element14; ComponentLink4URL: https://datasheet.ciiva.com/2493/pyu-r-int-thick-7-2493785.pdf?src-supplier=Digi-Key; ComponentLink4Description: https://datasheet.ciiva.com/2493/pyu-r-int-thick-7-2493785.pdf?src-supplier=Digi-Key; ComponentLink5URL: https://datasheet.ciiva.com/2493/pyu-r-int-thick-7-2493786.pdf?src-supplier=Digi-Key; ComponentLink5Description: https://datasheet.ciiva.com/2493/pyu-r-int-thick-7-2493786.pdf?src-supplier=Digi-Key; ComponentLink6URL: https://datasheet.ciiva.com/2493/pyu-r-int-thick-7-2493784.pdf?src-supplier=Digi-Key; ComponentLink6Description: https://datasheet.ciiva.com/2493/pyu-r-int-thick-7-2493784.pdf?src-supplier=Digi-Key; ComponentLink7URL: https://datasheet.ciiva.com/7672/1563626-7672233.pdf?src-supplier=Element14; ComponentLink7Description: https://datasheet.ciiva.com/7672/1563626-7672233.pdf?src-supplier=Element14; ComponentLink8URL: https://datasheet.ciiva.com/2493/pyu-r-int-thick-7-2493812.pdf?src-supplier=Digi-Key; ComponentLink8Description: https://datasheet.ciiva.com/2493/pyu-r-int-thick-7-2493812.pdf?src-supplier=Digi-Key; ComponentLink9URL: https://datasheet.ciiva.com/2493/pyu-r-int-thick-7-2493813.pdf?src-supplier=Digi-Key; ComponentLink9Description: https://datasheet.ciiva.com/2493/pyu-r-int-thick-7-2493813.pdf?src-supplier=Digi-Key; ComponentLink10URL: https://datasheet.ciiva.com/2493/pyu-r-int-thick-7-2493811.pdf?src-supplier=Digi-Key; ComponentLink10Description: https://datasheet.ciiva.com/2493/pyu-r-int-thick-7-2493811.pdf?src-supplier=Digi-Key; ComponentLink11URL: https://datasheet.ciiva.com/8892/pyu-rc0201-51-rohs-l-8-8892942.pdf?src-supplier=Avnet; ComponentLink11Description: https://datasheet.ciiva.com/8892/pyu-rc0201-51-rohs-l-8-8892942.pdf?src-supplier=Avnet; Supplier 1: Digi-Key; Supplier Part Number 1: 311-4.70KMCT-ND; Stock 1: 6149397; Pricing 1: 1=0,10000, 10=0,03700, 100=0,01530, 1000=0,00685, 2500=0,00595, 5000=0,00491 (USD); RoHS: Yes; Case/Package: 0201; Case Code (Metric): 0603; Case Code (Imperial): 0201; Weight: 6E-06oz; Contact Plating: Tin,Matte; Size Code: 0201; Min Operating Temperature: -55°C; Max Operating Temperature: 125°C; Tolerance: 1%; Packaging: Tape and Reel; Package Quantity: 1; Resistor Type: Thick Film; Number of Terminations: 2; Termination: SMD/SMT; Max Power Dissipation: 50mW; Features: Moisture Resistant; Series: RC; Resistance Tolerance: 1%; Construction: Rectangular; Length: 0.6mm; Width: 0.012inch; Height: 0.01inch; Depth: 0.3mm; Radiation Hardening: No; Military Standard: Not; Lead Free: Lead Free; RoHS Compliant: Yes
R47 R49 = Res_0402: Part Description: 3 kOhms ±1% 0.05W, 1/20W Chip Resistor 0201 (0603 Metric) Moisture Resistant Thick Film; Manufacturer: Yageo; Manufacturer Part Number 1: RC0201FR-073KL; Resistance: 3kR; Max Power Dissipation: 50mW; Temperature Coefficient: 200ppm/°C; Value: 3k, 1%; Supplier 1: Digi-Key; Supplier Part Number 1: YAG2656CT-ND; Stock 1: 269780; Pricing 1: 1=0,10000, 10=0,03700, 100=0,01530, 1000=0,00685, 2500=0,00595, 5000=0,00491 (USD); RoHS: Yes; Case/Package: 0201; Case Code (Metric): 0603; Case Code (Imperial): 0201; Min Operating Temperature: -55°C; Max Operating Temperature: 125°C; Packaging: Tape and Reel; Resistor Type: Thick Film; Number of Terminations: 2; Tolerance: 1%; Features: Moisture Resistant; Length: 0.024inch; Width: 0.012inch; Height: 0.01inch; RoHS Compliant: Yes; ComponentLink1URL: http://www.yageo.com/documents/recent/PYu-RC_Group_51_RoHS_L_10.pdf?src-supplier=Digi-Key; ComponentLink1Description: http://www.yageo.com/documents/recent/PYu-RC_Group_51_RoHS_L_10.pdf?src-supplier=Digi-Key; ComponentLink2URL: http://www.yageo.com.tw/exep/pages/download/literatures/PYu-R_INT-thick_7.pdf?src-supplier=Digi-Key; ComponentLink2Description: http://www.yageo.com.tw/exep/pages/download/literatures/PYu-R_INT-thick_7.pdf?src-supplier=Digi-Key; ComponentLink3URL: http://www.yageo.com/documents/recent/PYu-RC_Group_51_RoHS_L_9.pdf?src-supplier=Digi-Key; ComponentLink3Description: http://www.yageo.com/documents/recent/PYu-RC_Group_51_RoHS_L_9.pdf?src-supplier=Digi-Key
R50 = Res_0402: Manufacturer: Yageo; Manufacturer Part Number 1: RC0201FR-071KL; Part Description: 1 kOhms ±1% 0.05W, 1/20W Chip Resistor 0201 (0603 Metric) Moisture Resistant Thick Film; Resistance: 1kR; Power Rating: 50mW; Voltage Rating: 25V; Temperature Coefficient: 200ppm/°C; Value: 1k, 1%; Supplier 1: Digi-Key; Supplier Part Number 1: 311-1KMDKR-ND; Stock 1: 9099863; Pricing 1: 1=0,10000, 10=0,03700, 100=0,01530, 1000=0,00685, 2500=0,00595, 5000=0,00491 (USD); RoHS: Yes; Case/Package: 0201; Case Code (Metric): 0603; Case Code (Imperial): 0201; Contact Plating: Tin,Matte; Min Operating Temperature: -55°C; Max Operating Temperature: 125°C; Package Quantity: 10000; Packaging: Tape and Reel; Tolerance: 1%; Resistor Type: Thick Film; Number of Terminations: 2; Termination: SMD/SMT; Max Power Dissipation: 50mW; Working Voltage: 25V; Features: Moisture Resistant; Series: RC; Resistance Tolerance: 1%; Technology: THICK FILM; Construction: Rectangular; Length: 0.024inch; Width: 0.012inch; Height: 0.01inch; Depth: 0.3mm; Radiation Hardening: No; Military Standard: Not; Lead Free: Lead Free; RoHS Compliant: Yes; ComponentLink1URL: https://datasheet.ciiva.com/7672/1563626-7672204.pdf?src-supplier=Element14; ComponentLink1Description: https://datasheet.ciiva.com/7672/1563626-7672204.pdf?src-supplier=Element14; ComponentLink2URL: https://datasheet.ciiva.com/22698/1563626-22698505.pdf?src-supplier=Element14; ComponentLink2Description: https://datasheet.ciiva.com/22698/1563626-22698505.pdf?src-supplier=Element14; ComponentLink3URL: https://datasheet.ciiva.com/29721/pyu-r-int-thick-7-29721196.pdf?src-supplier=Digi-Key; ComponentLink3Description: https://datasheet.ciiva.com/29721/pyu-r-int-thick-7-29721196.pdf?src-supplier=Digi-Key; ComponentLink4URL: https://datasheet.ciiva.com/29721/pyu-r-int-thick-7-29721195.pdf?src-supplier=Digi-Key; ComponentLink4Description: https://datasheet.ciiva.com/29721/pyu-r-int-thick-7-29721195.pdf?src-supplier=Digi-Key; ComponentLink5URL: https://datasheet.ciiva.com/8896/pyu-rc0201-51-rohs-l-8-8896174.pdf?src-supplier=Avnet; ComponentLink5Description: https://datasheet.ciiva.com/8896/pyu-rc0201-51-rohs-l-8-8896174.pdf?src-supplier=Avnet
TP1-TP3 = TESTPOINT_PAD: Test Point PCB mount Miniature White